# EAGLE design sidInterface (EAGLE 5.11)
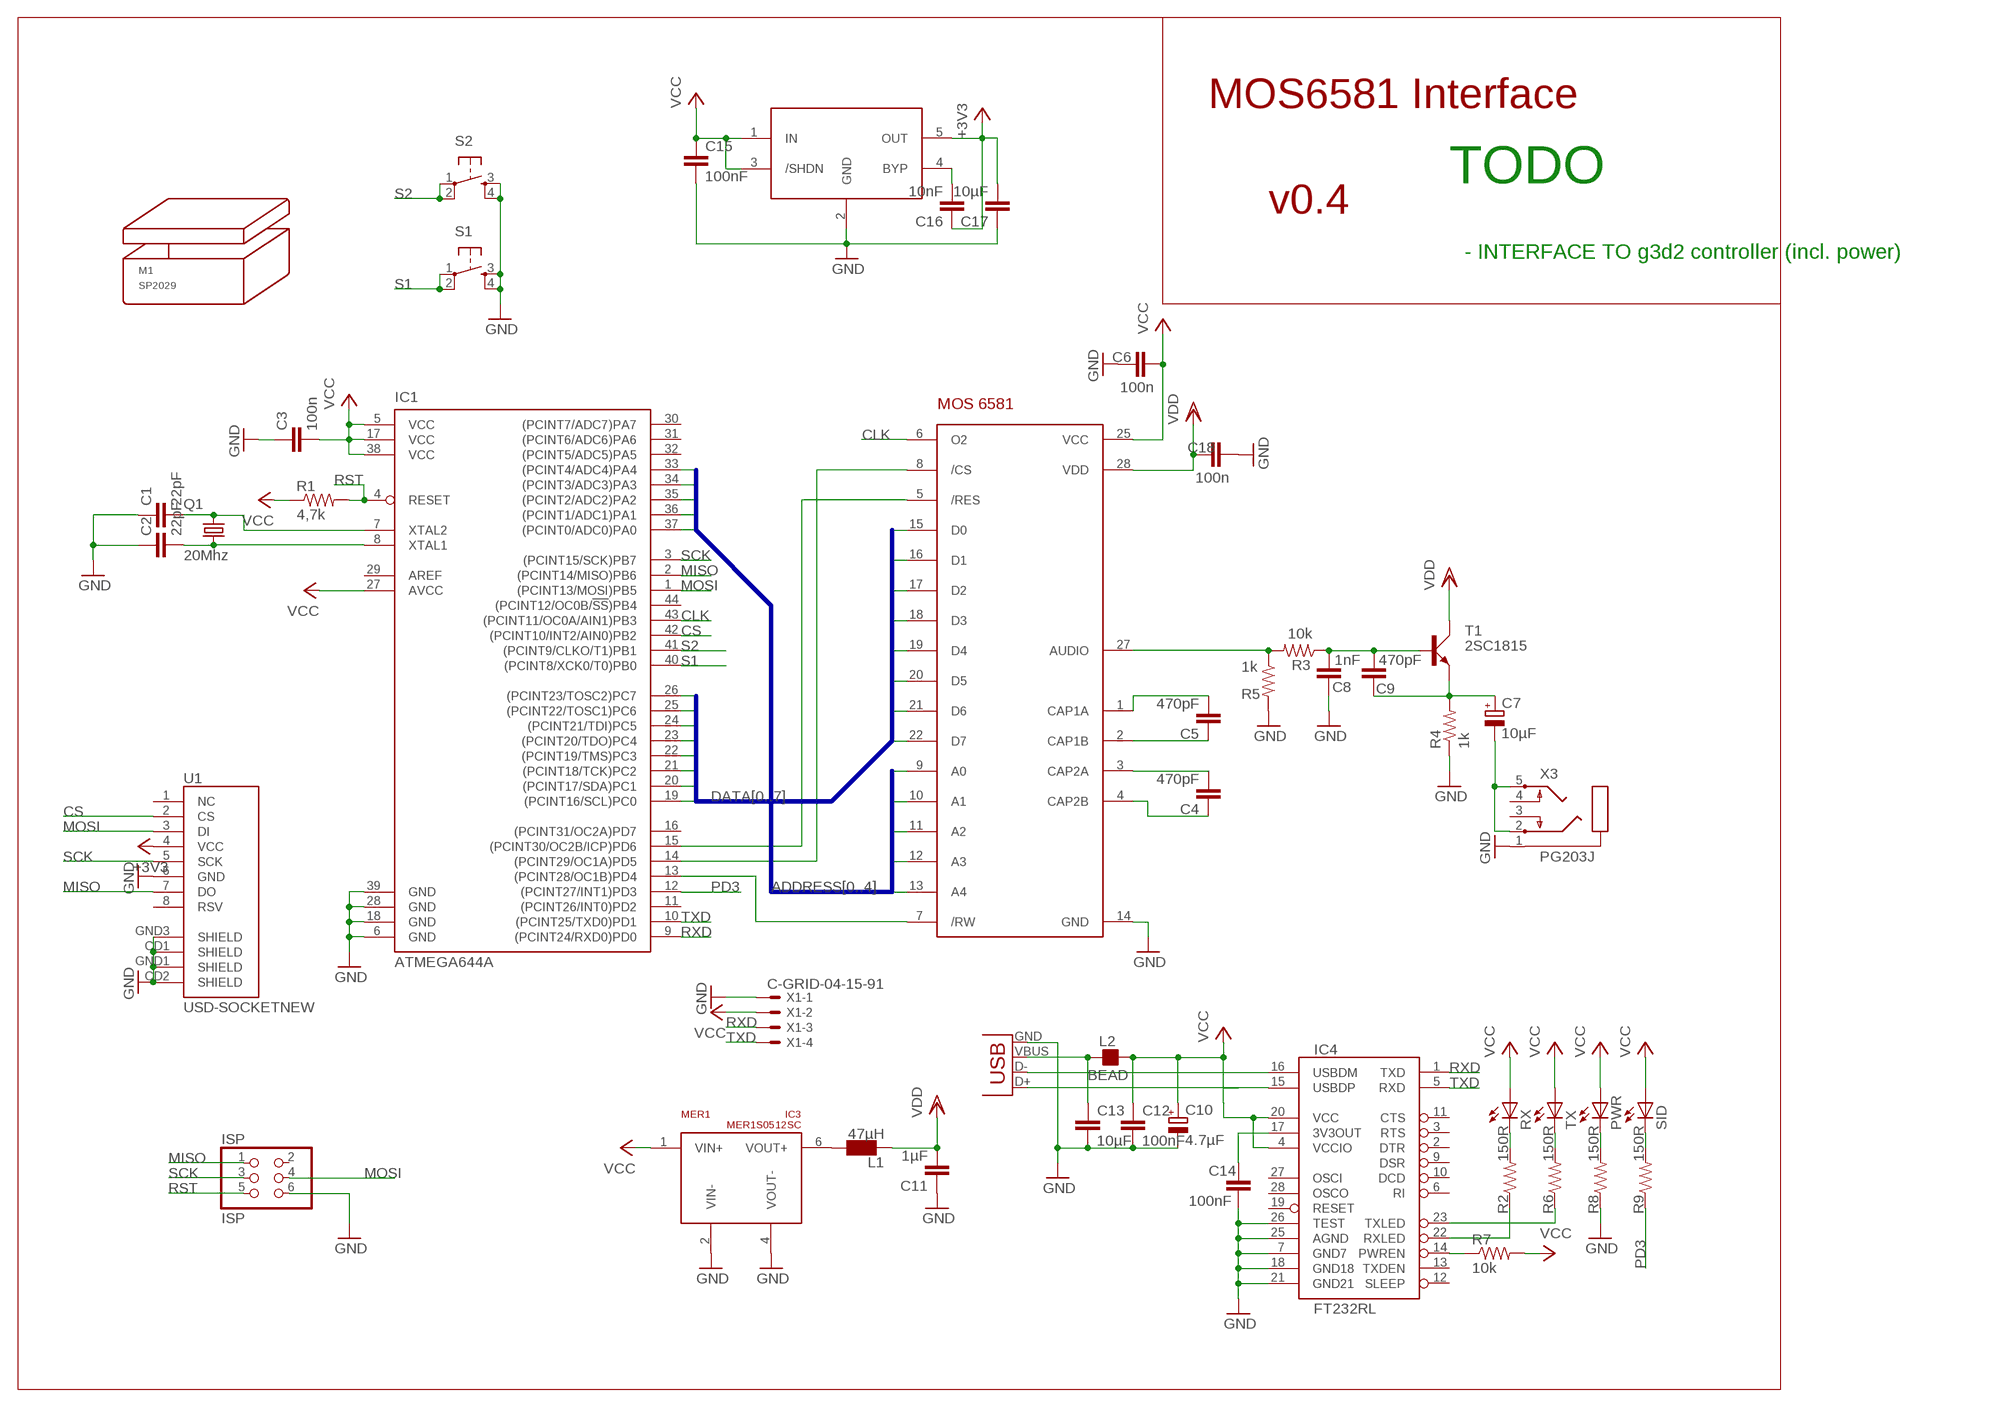
[diagram p0: schematic, sheet 1]

## Parts
C1  22pF  CAP0805  [0805]
C2  22pF  CAP0805  [0805]
C3  100n  CAP0805  [0805]
C4  470pF  CAP0805  [0805]
C5  470pF  CAP0805  [0805]
C6  100n  CAP0805  [0805]
C7  10µF  CPOL-EUSMCC  [SMC_C]
C8  1nF  CAP0805  [0805]
C9  470pF  CAP0805  [0805]
C10  4.7µF  CPOL-EUSMCC  [SMC_C]
C11  1µF  CAP0805  [0805]
C12  100nF  CAP0805  [0805]
C13  10µF  CAP0805  [0805]
C14  100nF  CAP0805  [0805]
C15  100nF  CAP0805  [0805]
C16  10nF  CAP0805  [0805]
C17  10µF  CAP0805  [0805]
C18  100n  CAP0805  [0805]
IC1  ATMEGA644A  [TQFP44]
IC2  MOS6581  [DIL28]
IC3  MER1S0512SC  MURATA_MER1  [MURATA_MER1]
IC4  FT232RL  FT232RLSSOP  [SSOP28DB]
IC5  LT1761  [SOT23-5L]
ISP  ISP  PINHD-2X03_2.54  [2X03]
L1  47µH  PIS2408  [PIS2408]
L2  BEAD  FB_0805  [L0805]
M1  SP2029  [SP2029]
PWR  LED3MM  [LED3MM]
Q1  20Mhz  X22-OSCILLATOR  [X22]
R1  4,7k  RESISTOR  [0805]
R2  150R  RESISTOR  [0805]
R3  10k  RESISTOR  [0805]
R4  1k  RESISTOR  [0805]
R5  1k  RESISTOR  [0805]
R6  150R  RESISTOR  [0805]
R7  10k  RESISTOR  [0805]
R8  150R  RESISTOR  [0805]
R9  150R  RESISTOR  [0805]
RX  LED3MM  [LED3MM]
S1  LSH  [LSH]
S2  LSH  [LSH]
SID  LED3MM  [LED3MM]
T1  2SC1815  BC547  [SOT54A]
TX  LED3MM  [LED3MM]
U1  USD-SOCKETNEW  [MICRO-SD-SOCKET-PP]
X1  C-GRID-04-15-91  [15-91-04]
X2  USB-SMD-NS  [USB-MINIB-NOSTOP]
X3  PG203J  [PG203J]

## Nets
+3V3: C16.1 C17.2 IC5.5(OUT) U1.4(VCC)
ADDRESS0: IC1.37((PCINT0/ADC0)PA0) IC2.9(A0)
ADDRESS1: IC1.36((PCINT1/ADC1)PA1) IC2.10(A1)
ADDRESS2: IC1.35((PCINT2/ADC2)PA2) IC2.11(A2)
ADDRESS3: IC1.34((PCINT3/ADC3)PA3) IC2.12(A3)
ADDRESS4: IC1.33((PCINT4/ADC4)PA4) IC2.13(A4)
CLK: IC1.43((PCINT11/OC0A/AIN1)PB3) IC2.6(O2)
CS: IC1.42((PCINT10/INT2/AIN0)PB2) U1.2(CS)
DATA0: IC1.19((PCINT16/SCL)PC0) IC2.15(D0)
DATA1: IC1.20((PCINT17/SDA)PC1) IC2.16(D1)
DATA2: IC1.21((PCINT18/TCK)PC2) IC2.17(D2)
DATA3: IC1.22((PCINT19/TMS)PC3) IC2.18(D3)
DATA4: IC1.23((PCINT20/TDO)PC4) IC2.19(D4)
DATA5: IC1.24((PCINT21/TDI)PC5) IC2.20(D5)
DATA6: IC1.25((PCINT22/TOSC1)PC6) IC2.21(D6)
DATA7: IC1.26((PCINT23/TOSC2)PC7) IC2.22(D7)
GND: C1.1 C2.1 C3.1 C6.1 C8.1 C10.- C11.1 C12.2 C13.2 C14.2 C15.2 C17.1 C18.2 IC1.6(GND) IC1.18(GND) IC1.28(GND) IC1.39(GND) IC2.14(GND) IC3.2(VIN-) IC3.4(VOUT-) IC4.7(GND7) IC4.18(GND18) IC4.21(GND21) IC4.25(AGND) IC4.26(TEST) IC5.2(GND) ISP.6 R4.1 R5.2 R8.1 S1.3 S1.4 S2.3 S2.4 U1.6(GND) U1.CD1(SHIELD) U1.CD2(SHIELD) U1.GND1(SHIELD) U1.GND3(SHIELD) X1.1 X2.GND X3.1
MISO: IC1.2((PCINT14/MISO)PB6) ISP.1 U1.7(DO)
MOSI: IC1.1((PCINT13/MOSI)PB5) ISP.4 U1.3(DI)
N$1: C2.2 IC1.8(XTAL1) Q1.1
N$2: C1.2 IC1.7(XTAL2) Q1.3
N$4: C4.2 IC2.3(CAP2A)
N$5: C5.1 IC2.2(CAP1B)
N$6: C4.1 IC2.4(CAP2B)
N$7: C5.2 IC2.1(CAP1A)
N$8: IC1.13((PCINT28/OC1B)PD4) IC2.7(/RW)
N$9: IC1.15((PCINT30/OC2B/ICP)PD6) IC2.5(/RES)
N$10: IC1.14((PCINT29/OC1A)PD5) IC2.8(/CS)
N$12: IC3.6(VOUT+) L1.P$1
N$13: R2.2 RX.K(C)
N$14: IC2.27(AUDIO) R3.2 R5.1
N$15: R6.2 TX.K(C)
N$16: C8.2 C9.2 R3.1 T1.B
N$17: C7.+ C9.1 R4.2 T1.E
N$18: IC4.16(USBDM) X2.D-
N$19: C7.- X3.2 X3.5
N$20: IC4.15(USBDP) X2.D+
N$21: PWR.K(C) R8.2
N$22: IC4.23(TXLED) R6.1
N$23: C13.1 L2.1 X2.VBUS
N$24: IC4.14(PWREN) R7.1
N$27: IC4.22(RXLED) R2.1
N$29: C14.1 IC4.17(3V3OUT)
N$43: C16.2 IC5.4(BYP)
PD3: IC1.12((PCINT27/INT1)PD3) R9.1
RST: IC1.4(RESET) ISP.5 R1.2
RXD: IC1.9((PCINT24/RXD0)PD0) IC4.1(TXD) X1.3
S1: IC1.40((PCINT8/XCK0/T0)PB0) S1.1 S1.2
S2: IC1.41((PCINT9/CLKO/T1)PB1) S2.1 S2.2
SCK: IC1.3((PCINT15/SCK)PB7) ISP.3 U1.5(SCK)
SID: R9.2 SID.K(C)
TXD: IC1.10((PCINT25/TXD0)PD1) IC4.5(RXD) X1.4
VCC: C3.2 C6.2 C10.+ C12.1 C15.1 IC1.5(VCC) IC1.17(VCC) IC1.27(AVCC) IC1.38(VCC) IC2.25(VCC) IC3.1(VIN+) IC4.4(VCCIO) IC4.20(VCC) IC5.1(IN) IC5.3(/SHDN) L2.2 PWR.A R1.1 R7.2 RX.A SID.A TX.A X1.2
VDD: C11.2 C18.1 IC2.28(VDD) L1.P$2 T1.C
Unconnected: IC1.11((PCINT26/INT0)PD2) IC1.16((PCINT31/OC2A)PD7) IC1.29(AREF) IC1.30((PCINT7/ADC7)PA7) IC1.31((PCINT6/ADC6)PA6) IC1.32((PCINT5/ADC5)PA5) IC1.44((PCINT12/OC0B/!SS!)PB4) IC4.2(DTR) IC4.3(RTS) IC4.6(RI) IC4.9(DSR) IC4.10(DCD) IC4.11(CTS) IC4.12(SLEEP) IC4.13(TXDEN) IC4.19(RESET) IC4.27(OSCI) IC4.28(OSCO) ISP.2 U1.1(NC) U1.8(RSV) X3.3 X3.4

## Buses
DATA[0..7]
ADDRESS[0..4]

## Notes on the sheet
- MOS6581 Interface
- TODO
- v0.4
- - INTERFACE TO g3d2 controller (incl. power)

## Library data of the parts
C1-C6 C8 C9 C11-C18 = SparkFun:CAP: Capacitor Standard 0603 ceramic capacitor, and 0.1" leaded capacitor.
C7 C10 = resistor:CPOL-EU: POLARIZED CAPACITOR, European symbol
IC1 = atmel:ATMEGA644: 8-bit Microcontroller with 64K Bytes In-System Programmable Flash Source: http://www.atmel.com/dyn/resources/prod_documents/doc2593.pdf; MPN: ATMEGA644PV-10AU; OC_FARNELL: 1455123; OC_NEWARK: 58M3748
IC2 = seb:MOS6581
IC3 = seb:MURATA_MER1
IC4 = SparkFun:FT232RL: USB UART FT232RL 4th Generation USB UART (USB <-> Serial) Controller. Spark Fun Electronics SKU : COM-00650
IC5 = seb:LT1761
ISP = pinhead-2:PINHD-2X03: PIN HEADER
L1 = seb:PIS2408
L2 = rc-master-smd:FB_: FERRITE BEAD
M1 = strapubox:SP2029: Gehäuse Strapubox Typ 2029 max. Bauteilhöhe, top-layer: 11,5 mm max. Bauteilhöhe, bottom-layer: 3,5 mm (Dicke der LP: 1,5 mm) Außenmaße: Länge: 80 mm Breite: 61 mm Höhe: 20,5 mm
PWR RX SID TX = led:LED: LED OSRAM: - CHIPLED LG R971, LG N971, LY N971, LG Q971, LY Q971, LO R971, LY R971 LH N974, LH R974 LS Q976, LO Q976, LY Q976 LO Q996 - Hyper CHIPLED LW Q18S LB Q993, LB Q99A, LB R99A - SideLED LS A670, LO A670, LY A670, LG A670, LP A670 LB A673, LV A673, LT A673, LW A673 LH A674 LY A675 LS A676, LA A676, LO A676, LY A676, LW A676 LS A679, LY A679, LG A679 - Hyper Micro SIDELED® LS Y876, LA Y876, LO Y876, LY Y876 LT Y87S - SmartLED LW L88C, LW L88S LB L89C, LB L89S, LG L890 LS L89K, LO L89K, LY L89K LS L896, LA L896, LO L896, LY L896 - TOPLED LS T670, LO T670, LY T670, LG T670, LP T670 LSG T670, LSP T670, LSY T670, LOP T670, LYG T670 LG T671, LOG T671, LSG T671 LB T673, LV T673, LT T673, LW T673 LH T674 LS T676, LA T676, LO T676, LY T676, LB T676, LH T676, LSB T676, LW T676 LB T67C, LV T67C, LT T67C, LS T67K, LO T67K, LY T67K, LW E67C LS E67B, LA E67B, LO E67B, LY E67B, LB E67C, LV E67C, LT E67C LW T67C LS T679, LY T679, LG T679 LS T770, LO T770, LY T770, LG T770, LP T770 LB T773, LV T773, LT T773, LW T773 LH T774 LS E675, LA E675, LY E675, LS T675 LS T776, LA T776, LO T776, LY T776, LB T776 LHGB T686 LT T68C, LB T68C - Hyper Mini TOPLED® LB M676 - Mini TOPLED Santana® LG M470 LS M47K, LO M47K, LY M47K Source: http://www.osram.convergy.de LUXEON: - LUMILED® LXK2-PW12-R00, LXK2-PW12-S00, LXK2-PW14-U00, LXK2-PW14-V00 LXK2-PM12-R00, LXK2-PM12-S00, LXK2-PM14-U00 LXK2-PE12-Q00, LXK2-PE12-R00, LXK2-PE12-S00, LXK2-PE14-T00, LXK2-PE14-U00 LXK2-PB12-K00, LXK2-PB12-L00, LXK2-PB12-M00, LXK2-PB14-N00, LXK2-PB14-P00, LXK2-PB14-Q00 LXK2-PR12-L00, LXK2-PR12-M00, LXK2-PR14-Q00, LXK2-PR14-R00 LXK2-PD12-Q00, LXK2-PD12-R00, LXK2-PD12-S00 LXK2-PH12-R00, LXK2-PH12-S00 LXK2-PL12-P00, LXK2-PL12-Q00, LXK2-PL12-R00 Source: www.luxeon.com KINGBRIGHT: KA-3528ASYC Source: www.kingbright.com
Q1 = seb:X22-OSCILLATOR
R1-R9 = SparkFun:RESISTOR: Resistor Basic schematic elements and footprints for 0603, 1206, and PTH 1/10th watt (small) resistors.
S1 S2 = switch-tact:LSH
T1 = transistor-small-signal:BC547: NPN TRANSISTOR
U1 = SparkFun:USD-SOCKET: microSD Socket Push-push type uSD socket. Schematic element and footprint production proven. Spark Fun Electronics SKU : PRT-00127. tDoc lines correctly indicate media card edge positions when inserting (unlocked, locked, depressed).
X1 = con-molex:C-GRID-04: CONNECTOR wire to board 2.54 mm (0.100") pitch header; OC_FARNELL: unknown; OC_NEWARK: unknown
X2 = SparkFun:USB: USB Connectors USB-B-PTH is fully proven SKU : PRT-00139 USB-miniB is fully proven SKU : PRT-00587 USB-A-PCB is untested. USB-A-H is throughly reviewed, but untested. Spark Fun Electronics SKU : PRT-00437 USB-B-SMT is throughly reviewed, but untested. Needs silkscreen touching up. USB-A-S has not been used/tested USB-MB-H has not been used/tested
X3 = con-hirschmann:PG203J: MIC/HEADPHONE JACK KS-S stereo microphone/headphone jack PG203JN (Schukat); OC_FARNELL: unknown; OC_NEWARK: unknown

## Board
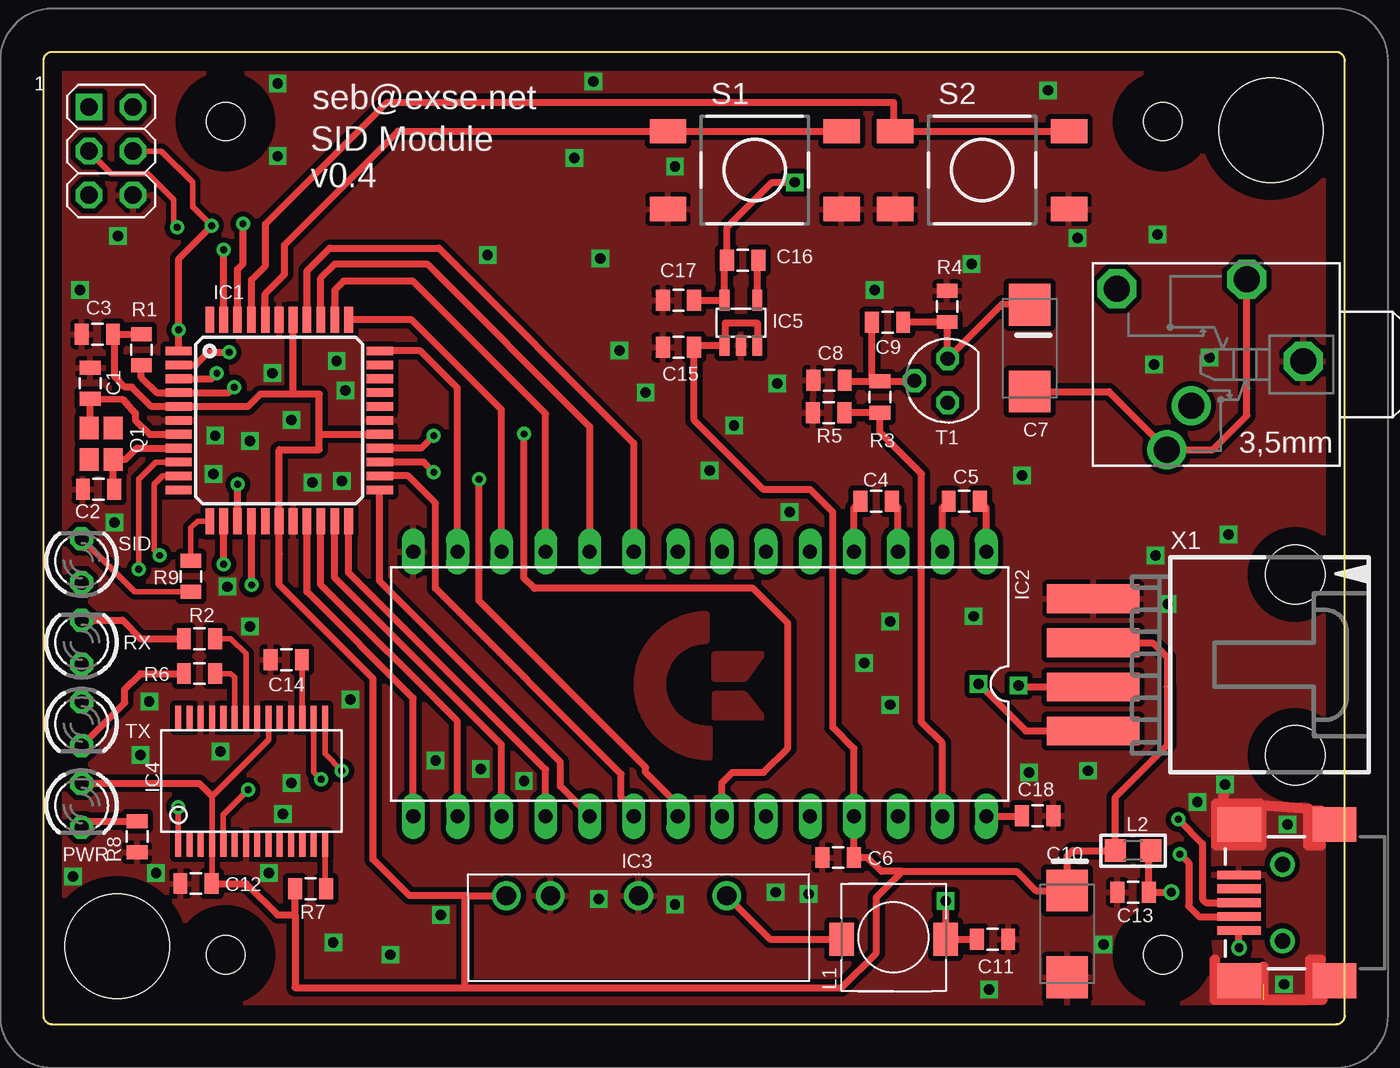
[diagram p1: board, top side]
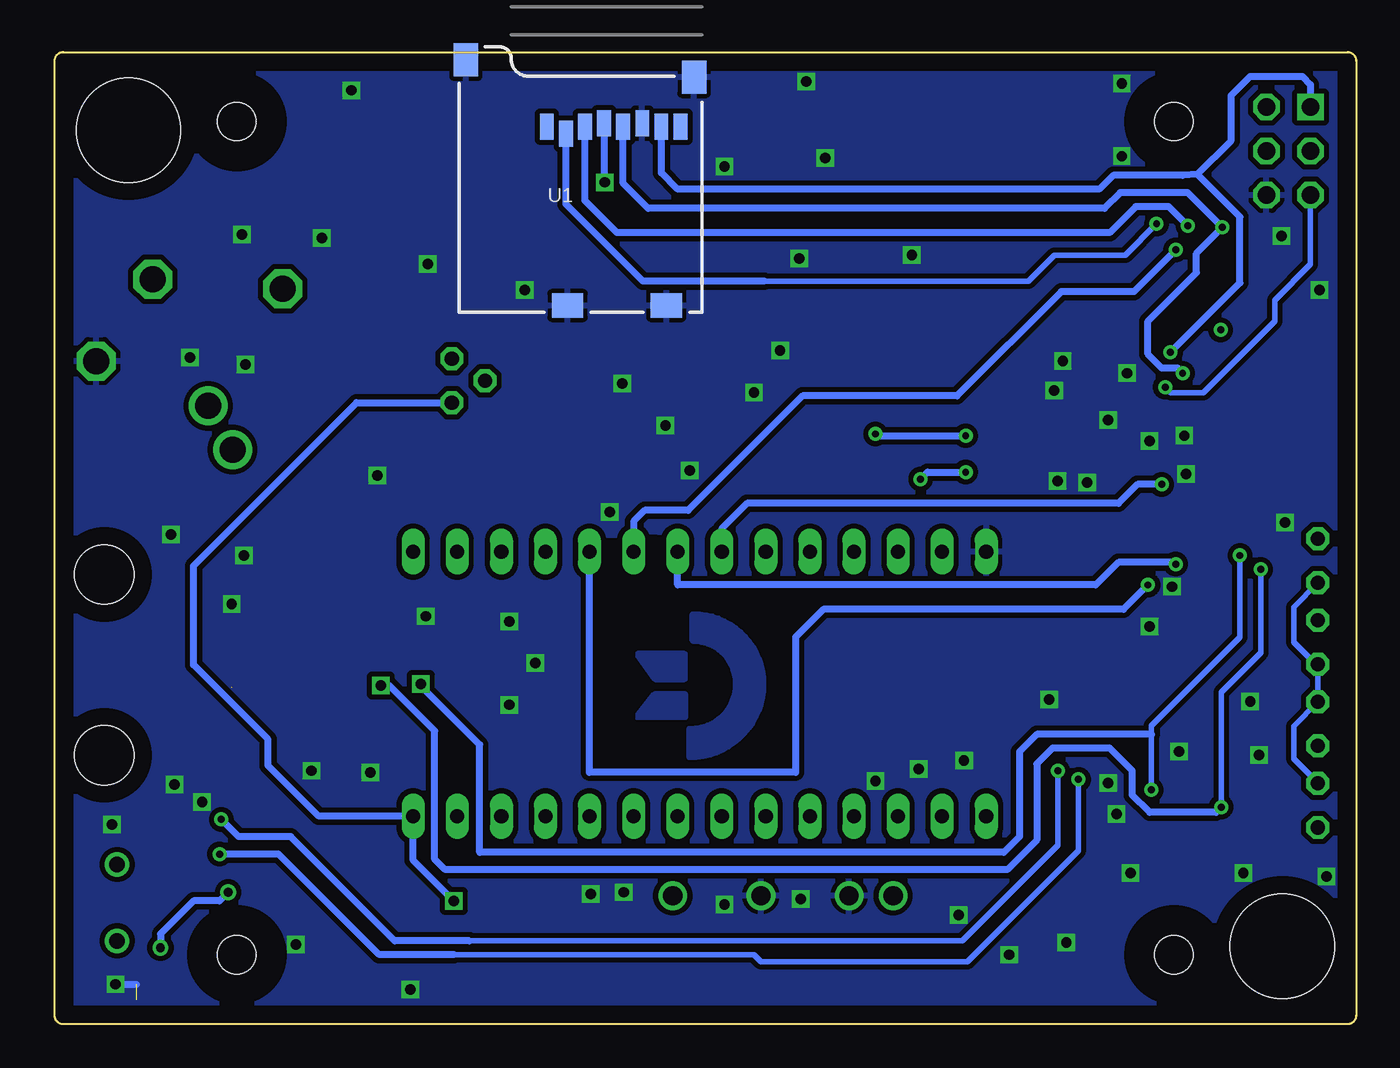
[diagram p2: board, bottom side, seen from below]

Size 75 x 56 mm. Coordinates in mm from the lower left corner, seen from the top.
Copper layers (1*16): Top 0.035mm / dielectric 1.5mm / Bottom 0.035mm
Design rules "default *": minimum track width 10mil, minimum drill 0.4mm, track to track 8mil, track to pad 8mil, pad to pad 8mil, via to via 8mil, smd to smd 8mil, copper to edge 40mil, drill to drill 8mil, minimum pad ring 10mil, minimum via ring 8mil, stop-mask expansion 4mil, vias tented up to drill 24mil, thermal gap 10mil
tRestrict: 2 lines
bRestrict: 2 lines

### Footprints (pad centres in the part's own frame; a part is rotated, then mirrored left to right if it is on the bottom)
0805 = smd 0.8 x 1.2: 1 -0.9,0; 2 0.9,0
SMC_C = smd 2.4 x 2.4: + -2.5,0; - 2.5,0
TQFP44 = smd 1.5 x 0.5: 1 -5.8,4; 2 -5.8,3.2; 3 -5.8,2.4; 4 -5.8,1.6; 5 -5.8,0.8; 6 -5.8,0; 7 -5.8,-0.8; 8 -5.8,-1.6; 9 -5.8,-2.4; 10 -5.8,-3.2; 11 -5.8,-4; 23 5.8,-4; 24 5.8,-3.2; 25 5.8,-2.4; 26 5.8,-1.6; 27 5.8,-0.8; 28 5.8,0; 29 5.8,0.8; 30 5.8,1.6; 31 5.8,2.4; 32 5.8,3.2; 33 5.8,4 | smd 0.5 x 1.5: 12 -4,-5.8; 13 -3.2,-5.8; 14 -2.4,-5.8; 15 -1.6,-5.8; 16 -0.8,-5.8; 17 0,-5.8; 18 0.8,-5.8; 19 1.6,-5.8; 20 2.4,-5.8; 21 3.2,-5.8; 22 4,-5.8; 34 4,5.8; 35 3.2,5.8; 36 2.4,5.8; 37 1.6,5.8; 38 0.8,5.8; 39 0,5.8; 40 -0.8,5.8; 41 -1.6,5.8; 42 -2.4,5.8; 43 -3.2,5.8; 44 -4,5.8
DIL28 = drill 0.813 long: 1 -16.51,-7.62; 2 -13.97,-7.62; 3 -11.43,-7.62; 4 -8.89,-7.62; 5 -6.35,-7.62; 6 -3.81,-7.62; 7 -1.27,-7.62; 8 1.27,-7.62; 9 3.81,-7.62; 10 6.35,-7.62; 11 8.89,-7.62; 12 11.43,-7.62; 13 13.97,-7.62; 14 16.51,-7.62; 15 16.51,7.62; 16 13.97,7.62; 17 11.43,7.62; 18 8.89,7.62; 19 6.35,7.62; 20 3.81,7.62; 21 1.27,7.62; 22 -1.27,7.62; 23 -3.81,7.62; 24 -6.35,7.62; 25 -8.89,7.62; 26 -11.43,7.62; 27 -13.97,7.62; 28 -16.51,7.62
MURATA_MER1 = drill 1.1 round: 1 -7.62,0; 2 -5.08,0; 4 0,0; 6 5.08,0
SSOP28DB = smd 0.348 x 1.397: 1 -4.225,-3.656; 2 -3.575,-3.656; 3 -2.925,-3.656; 4 -2.275,-3.656; 5 -1.625,-3.656; 6 -0.975,-3.656; 7 -0.325,-3.656; 8 0.325,-3.656; 9 0.975,-3.656; 10 1.625,-3.656; 11 2.275,-3.656; 12 2.925,-3.656; 13 3.575,-3.656; 14 4.225,-3.656; 15 4.225,3.656; 16 3.575,3.656; 17 2.925,3.656; 18 2.275,3.656; 19 1.625,3.656; 20 0.975,3.656; 21 0.325,3.656; 22 -0.325,3.656; 23 -0.975,3.656; 24 -1.625,3.656; 25 -2.275,3.656; 26 -2.925,3.656; 27 -3.575,3.656; 28 -4.225,3.656
SOT23-5L = smd 0.55 x 1.2: 1 -0.95,-1.3; 2 0,-1.3; 3 0.95,-1.3; 4 0.95,1.3; 5 -0.95,1.3
2X03 = drill 1.016 square: 1 -2.54,-1.27 | drill 1.016 octagon: 2 -2.54,1.27; 3 0,-1.27; 4 0,1.27; 5 2.54,-1.27; 6 2.54,1.27
PIS2408 = smd 1.4 x 1.9: P$1 -3,-0.1; P$2 3,-0.1
L0805 = smd 1.2 x 1.3: 1 -1.016,0; 2 1.016,0
SP2029 = hole 2.2: -27,-24; -27,24; 27,24; 27,-24 | hole 6: 33.25,23.5; -33.25,-23.5
LED3MM = drill 0.813 octagon: A -1.27,0; K 1.27,0
X22 = smd 1.3 x 1.1: 1 0.9,0.7; 2 -0.9,0.7; 3 -0.9,-0.7; 4 0.9,-0.7
LSH = smd 2.1 x 1.4: 1 -5.005,2.24; 2 5.015,2.24; 3 -5.005,-2.24; 4 5.005,-2.24
SOT54A = drill 0.813 octagon: B 0,1.905; C -1.27,0; E 1.27,0
MICRO-SD-SOCKET-PP = smd 0.8 x 1.5: 1 -8.94,10.7; 2 -7.84,10.3; 3 -6.74,10.7; 4 -5.64,10.9; 5 -4.54,10.7; 6 -3.44,10.9; 7 -2.34,10.7; 8 -1.24,10.7 | smd 1.8 x 1.4: CD1 -2.05,0.4; CD2 -7.75,0.4 | smd 1.4 x 1.9: GND1 -13.6,14.55; GND3 -0.45,13.55
15-91-04 = smd 1.651 x 5.334: 1 -3.81,-10.795; 2 -1.27,-10.795; 3 1.27,-10.795; 4 3.81,-10.795 | hole 3.404: -5.207,0.838; 5.207,0.838
USB-MINIB-NOSTOP = smd 2.5 x 0.5: D+ 2.5,0; D- 2.5,0.8; GND 2.5,-1.6; ID 2.5,-0.8; VBUS 2.5,1.6 | smd 2.5 x 2: G1 -3,-4.5; G2 -3,4.5; G3 2.5,4.5; G4 2.5,-4.5 | drill 0.9 pad 0.8 round: H1 0,2.2 | drill 0.9 pad 0.787 round: H2 0,-2.2
PG203J = drill 1.499 octagon: 1 -5.004,-0.203; 4 5.74,-4.369; 5 -1.753,-4.902 | drill 1.499 round: 2 2.845,4.902; 3 1.448,2.388

### Placement (x,y rotation side)
C1  2.7,36.92 270 top
C2  3.18,30.82 0 top
C3  3.11,39.74 0 top
C4  47.99,30.13 0 top
C5  53.07,30.13 0 top
C6  45.8,9.6 0 top
C7  56.84,38.94 270 top
C8  45.28,37.1 0 top
C9  48.65,40.44 180 top
C10  59,5.2 270 top
C11  54.7,4.9 180 top
C12  8.8,8.1 180 top
C13  62.8,7.6 180 top
C14  14,21 180 top
C15  36.6,39 180 top
C16  40.3,44 0 top
C17  36.6,41.7 0 top
C18  57.3,12 0 top
IC1  13.59,34.78 0 top
IC2  37.83,19.6 180 top
IC3  34.3,7.4 0 top
IC4  12,14 0 top
IC5  40.2,40.4 0 top
ISP  3.9,50.3 270 top
L1  49,5 0 top
L2  62.8,10 180 top
M1  37.5,28 0 top
PWR  2.2,12.6 270 top
Q1  3.33,33.44 270 top
R1  5.65,38.85 270 top
R2  9,22.2 180 top
R3  48.2,36.13 270 top
R4  52.08,41.35 270 top
R5  45.26,35.23 180 top
R6  9,20.2 180 top
R7  15.4,7.8 180 top
R8  5.4,10.8 90 top
R9  8.5,25.8 270 top
RX  2.2,22 90 top
S1  41,49.2 0 top
S2  54.1,49.2 0 top
SID  2.2,26.7 90 top
T1  52.11,37.07 90 top
TX  2.2,17.3 270 top
U1  37.7,41 0 bottom
X1  71.3,20.7 270 top
X2  71.4,7 180 top
X3  67.6,38 180 top

### Tracks (layer width: path | path; a pad name or v marks a point on that pad's centre or on a via)
+3V3  (via drill 0.6)
  Top 0.406: C17.2 IC5.5 39.25,43.85 C16.1 39.4,45.9 42,48.5 v43.3,48.5
  Bottom 0.406: U1.4 43.3,51.9 v43.3,48.5
ADDRESS0
  Top 0.406: IC2.9 34.02,33.48 22.8,44.7 16.5,44.7 15.19,43.39 IC1.37
ADDRESS1
  Top 0.406: IC2.10 31.48,34.42 22.1,43.8 16.8,43.8 15.99,42.99 IC1.36
ADDRESS2
  Top 0.406: IC2.11 28.94,35.16 21.3,42.8 17.3,42.8 16.79,42.29 IC1.35
ADDRESS3
  Top 0.406: IC2.12 26.4,35.4 21.22,40.58 IC1.34
ADDRESS4
  Top 0.406: IC2.13 23.86,36.64 21.72,38.78 IC1.33
C64
  pour Bottom: 38.2,23.6 arc90 34.2,19.6 arc90 38.4,15.4 38.4,17 38.3,17 arc-90 35.7,19.6 arc-90 38.2,22.1 38.2,23.5 arc90
  pour Bottom: 38.7,17.7 41.4,17.7 40.4,19 38.7,19
  pour Bottom: 38.7,21.3 41.4,21.3 40.4,19.9 38.7,19.9
  pour Top: 38.2,23.6 arc90 34.2,19.6 arc90 38.4,15.4 38.4,17 38.3,17 arc-90 35.7,19.6 arc-90 38.2,22.1 38.2,23.5 arc90
  pour Top: 38.7,21.3 41.4,21.3 40.4,19.9 38.7,19.9
  pour Top: 38.7,17.7 41.4,17.7 40.4,19 38.7,19
CLK  (via drill 0.4)
  Top 0.406: v10.4,44.6 IC1.43
  Bottom 0.406: v10.4,44.6 12.8,42.2 17,42.2 23,36.2 31.9,36.2 38.5,29.6 41,29.6 41.64,28.96 IC2.6
CS  (via drill 0.4)
  Top 0.406: v11.5,46.1 11.5,43.8 11.19,43.49 IC1.42
  Bottom 0.305: 34.1,42.8 18.9,42.8 17.4,44.3 13.3,44.3 v11.5,46.1
  Bottom 0.406: U1.2 45.54,47.24 41.1,42.8 34.1,42.8
DATA0
  Top 0.406: IC2.15 21.32,18.78 15.19,24.91 IC1.19
DATA1
  Top 0.406: IC2.16 23.86,17.44 15.99,25.31 IC1.20
DATA2
  Top 0.406: IC2.17 26.4,16.1 16.79,25.71 IC1.21
DATA3
  Top 0.406: IC2.18 28.94,14.66 17.59,26.01 IC1.22
DATA4
  Top 0.406: IC1.23 19.39,25.51 29.8,15.1 29.8,13.7 31.48,12.02 IC2.19
DATA5
  Top 0.406: IC1.24 21.02,31.58 22.6,30 22.6,25.1 33.3,14.4 33.3,13.1 33.92,12.48 33.92,11.98 IC2.20
DATA6  (via drill 0.4)
  Top 0.406: v22.5,31.8 21.92,32.38 IC1.25 | IC2.21 36.56,12.64 34.7,14.5 34.7,14.8 25.1,24.4 v25.1,31.4
  Bottom 0.406: v25.1,31.4 24.7,31.8 v22.5,31.8
DATA7  (via drill 0.4)
  Top 0.406: IC2.22 39.1,13.9 39.7,14.5 41.5,14.5 42.9,15.9 42.9,23.1 40.9,25.1 28.3,25.1 27.7,25.7 v27.7,34 | v22.5,33.9 21.78,33.18 IC1.26
  Bottom 0.406: v27.7,34 27.6,33.9 v22.5,33.9
GND  (via drill 0.6)  (1 unrouted)
  Top 0.305: IC4.7 11.68,10.22 | 9.73,17.32 IC4.25 | IC4.26 9.08,17.52 | IC4.21 12.33,17.82 | IC4.18 14.28,17.74
  Top 0.61: 67.6,10.4 67.6,12.7 70.1,12.7 70.2,12.6 | 70.2,12.6 70.2,10.3 67.6,10.3 67.6,10.4 | 73.6,10.3 72.9,10.3 72.9,12.4 | 73.6,12.3 73,12.3 72.9,12.4 | 73.6,3.7 73,3.7 73,1.4 | 73,1.4 73.7,1.4 | 67.5,3.7 67.5,1.4 70.3,1.4 | 70.3,1.4 70.3,3.3 | 67.6,10.4 v68.1,13.8 | 70.2,12.6 72.9,12.4 | 70.3,1.4 73,1.4
  Bottom 0.406: v71.5,2.3 70.3,2.3
  other vias: 11.9,33.6 32,7.2 14.3,34.8 17.2,31.3 16.9,38.2 13.5,54.2 9.9,33.9 57.9,53.8 64.2,45.5 13.2,37.5 17.4,36.5 15.5,31.2 17.7,18.7 4.1,28.9 10.6,25.2 25.2,14.7 22.6,15.2 5.6,15.5 22.9,6.3 64.8,24.2 53.6,23.5 48.8,23.2 48.8,18.4 1.7,8.5 14.3,13.9 16.7,4.7 13,8.7 13.8,12.1 10.2,15.7 6.1,18.6 11.9,22.9 4.3,45.4 31.7,54.3 36.4,49.4 66.5,12.8 60.2,14.6 71.7,11.5 56.8,14.5 33.2,38.8 36.4,6.9 54.5,2 61.1,4.6 20,4 47.9,42.3 64.1,27 25.6,44.3 13.5,50 27.7,14 42.2,7.6 44.1,7.5 68.3,28.2 53.5,43.8 9.8,31.7 47.3,20.8 34.7,36.4 67.2,38.4 64,38 59.6,45.3 30.6,49.9 42.3,36.9 38.4,31.9 56.4,31.6 43,29.5 39.8,34.5 32.1,44.1 2.1,42.3 6.5,8.7
  pour Top (isolate 0.3): -0.6,56.6 76,56.6 75.3,-0.6 -0.6,-0.5
  pour Bottom (isolate 0.3): -0.5,56.6 75.8,56.5 75.3,-0.6 -0.6,-0.4
MISO  (via drill 0.4)
  Top 0.406: v10.7,38.7 9.5,38.7 8.78,37.98 IC1.2
  Bottom 0.406: 10.7,38.9 v10.7,38.7 6.7,42.7 6.7,46.5 9.15,48.95 | U1.7 40.04,49.04 39.1,48.1 14.8,48.1 14,48.9 10,48.9 9.15,48.95 | ISP.1 2.63,54.13 3.1,54.6 6.1,54.6 7.2,53.5 7.2,50.9 9.15,48.95
MOSI  (via drill 0.4)
  Top 0.305: ISP.4 6.8,50.3 8.6,48.5 8.6,47.1 v9.7,46
  Top 0.406: IC1.1 7.81,38.8 v7.8,40 7.8,44.1 v9.7,46
  Bottom 0.406: U1.3 44.44,47.44 42.6,45.6 14.2,45.6 12.7,47.1 10.8,47.1 v9.7,46
N$1
  Top 0.406: C2.2 4.03,30.67 Q1.1 4.74,32.54 5.38,33.18 IC1.8
N$2
  Top 0.406: 2.83,34.35 Q1.3 2.7,34.41 C1.2 4.6,36 5.3,35.2 5.3,34.8 6.12,33.98 IC1.7
N$4
  Top 0.406: C4.2 49.26,29.76 IC2.3
N$5
  Top 0.406: C5.1 51.8,29.76 IC2.2
N$6
  Top 0.406: C4.1 46.72,29.76 IC2.4
N$7
  Top 0.406: C5.2 54.34,29.76 IC2.1
N$8  (via drill 0.4)
  Top 0.406: v10.4,26.5 IC1.13
  Bottom 0.406: IC2.7 39.1,25.3 15,25.3 13.7,26.6 10.5,26.6 v10.4,26.5
N$9  (via drill 0.4)
  Top 0.406: v12,25.3 IC1.15
  Bottom 0.406: IC2.5 44.18,14.5 32.3,14.5 32.3,20.1 32.3,20.6 32.3,22.3 30.7,23.9 13.4,23.9 v12,25.3
N$10  (via drill 0.4)
  Top 0.406: v11.2,31.1 IC1.14
  Bottom 0.406: v11.2,31.1 12.6,31.1 13.7,30 35.1,30 36.56,28.54 IC2.8
N$12
  Top 0.406: L1.P$1 41.88,4.9 IC3.6
N$13
  Top 0.406: R2.2 5.6,22.2 4.57,23.27 RX.K
N$14
  Top 0.406: R5.1 R3.2 48.2,34.1 50.6,31.7 50.6,17.4 51.8,16.2 IC2.27
N$15
  Top 0.406: TX.K 4.7,18.53 4.7,19.3 5.6,20.2 R6.2
N$16
  Top 0.406: T1.B 50.2,37.03 R3.1 47.75,37.03 | 47.75,37.03 46,37.03 C8.2 | 47.75,37.03 C9.2
N$17
  Top 0.406: C9.1 R4.2 52.11,39.85 T1.E 55.26,41.49 C7.+
N$18  (via drill 0.4)
  Top 0.305: IC4.16 15.58,14.52 v16,14.1
  Top 0.406: X2.D- 66.6,6.2 66,6.8 66,9.3 v65.5,9.8
  Bottom 0.305: 52,4 34.7,4 34.3,3.6 22.4,3.6 16,10 v16,14.1
  Bottom 0.406: 52,4 56.3,4 62.1,9.8 v65.5,9.8
N$19
  Top 0.406: X3.5 69.35,35.05 67.4,33.1 X3.2 61.41,36.44 C7.-
N$20  (via drill 0.4)
  Top 0.305: IC4.15 16.23,15.57 v17.2,14.6
  Top 0.406: X2.D+ 67,7 66.8,7.2 66.8,10.4 v65.4,11.8
  Bottom 0.305: 51.1,4.8 22.7,4.8 17.2,10.3 v17.2,14.6
  Bottom 0.406: 51.1,4.8 55.4,4.8 61.4,10.8 64.4,10.8 v65.4,11.8
N$21
  Top 0.406: PWR.K 2.23,11.33 2.6,11.7 R8.2
N$22
  Top 0.305: IC4.23 11.03,19.98 10.8,20.2 R6.1
N$23  (via drill 0.5)
  Top 0.406: v68.9,4.4 X2.VBUS | v65,7.6 C13.1 63.7,9.88 L2.1
  Bottom 0.406: v68.9,4.4 68.9,5.2 67,7.1 65.5,7.1 v65,7.6
N$24
  Top 0.305: IC4.14 16.23,7.8 R7.1
N$27
  Top 0.305: IC4.22 11.68,21.32 10.8,22.2 R2.1
N$29
  Top 0.305: IC4.17 14.93,19.77 C14.1
N$43
  Top 0.406: C16.2 41.15,43.95 IC5.4
PD3
  Top 0.305: IC1.12 8.88,28.98 8.5,28.6 R9.1
RST  (via drill 0.4)
  Top 0.406: R1.2 5.65,37.25 6.52,36.38 IC1.4 10.68,36.38 v11,36.7
  Bottom 0.305: ISP.5 2.63,43.77 4.7,41.7 4.7,40.48 8.8,36.38 10.68,36.38 v11,36.7
RXD  (via drill 0.4, 0.6)
  Top 0.305: IC1.9 6.48,32.38 5.5,31.4 v5.5,26.2 | IC4.1 v7.78,12.5
  Top 0.406: v56.2,19.5 56.27,19.43 X1.3
  Bottom 0.305: v7.78,12.5 7.78,19.12 5.5,21.4 v5.5,26.2
  Bottom 0.406: v7.78,12.5 8.08,12.2 11.9,12.2 12.9,13.2 12.9,14.6 14.2,15.9 17.5,15.9 18.4,15 18.4,10.6 20.1,8.9 52.5,8.9 53.1,9.5 53.1,16.9 55.7,19.5 v56.2,19.5
S1
  Top 0.406: S1.2 S1.1 20.44,51.44 13.9,44.9 13.9,43.2 12.79,42.09 IC1.40
S2
  Top 0.406: S2.2 S2.1 49,51.53 49,53.1 19.8,53.1 12.8,46.1 12.8,43.7 11.99,42.89 IC1.41
SCK  (via drill 0.4)
  Top 0.305: ISP.3 2.63,50.27 3.9,49 6,49 7.5,47.5 7.5,46.1 v7.7,45.9
  Top 0.406: v10,37.5 9.68,37.18 IC1.3
  Bottom 0.406: U1.5 42.24,48.44 40.8,47 14.5,47 13.6,47.9 9.7,47.9 v7.7,45.9 9.2,44.4 9.2,43.3 12,40.5 12,38.6 11.2,37.8 10.3,37.8 v10,37.5
SID
  Top 0.305: R9.2 5.27,24.9 SID.K
TXD  (via drill 0.4, 0.6)
  Top 0.305: IC4.5 10.38,12.07 v11.8,13.5 | IC1.10 6.88,31.58 6.4,31.1 6.4,27.3 v6.7,27
  Top 0.406: v53.9,19.6 56.61,16.89 X1.4
  Bottom 0.305: v11.8,13.5 11.8,16.7 11.8,17.2 6.7,22.3 v6.7,27
  Bottom 0.406: 11.8,16.7 18.4,16.7 19.4,15.7 19.4,10.8 20.3,9.9 50.5,9.9 50.5,16.1 53.9,19.5 v53.9,19.6
VCC  (1 unrouted)
  Top 0.305: IC4.20 12.98,16.38 9.73,13.12 IC4.4 9.73,8.32 C12.1
  Top 0.406: 15.9,33.98 IC1.27 | 15.9,33.98 15.9,33.1 13.59,33.1 IC1.17 13.59,27.1 13.6,27.1 13.6,25.3 19,19.9 19,9.5 21.1,7.4 24.3,7.4 | 14.39,36.3 15.9,36.3 15.9,33.98 | 14.39,36.3 IC1.38 | 14.39,36.3 12.5,36.3 11.78,35.58 IC1.5 6.22,35.58 5.1,36.7 4.7,36.7 4.1,37.3 4.1,39.65 C3.2 R1.1 | 24.3,2.1 14.5,2.1 14.5,6.3 | 24.3,2.1 24.3,7.4 | 24.3,7.4 IC3.1 | 24.3,2.1 46,2.1 48,4.1 48,7.3 49.5,8.8 | IC5.3 41.15,40.4 39.3,40.4 39.3,39.15 IC5.1 37.6,39.1 C15.1 37.5,34.8 41.5,30.8 44.2,30.8 45.5,29.5 45.5,17.1 46.72,15.88 IC2.25 46.7,11.98 C6.2 47.5,9.6 48.3,8.8 49.5,8.8 | 64.8,19.4 64.8,16.1 61.78,13.08 L2.2 59.3,10 59,9.7 C10.+ 57.2,7.7 56.1,8.8 49.5,8.8 | 9.73,13.12 8.98,13.87 PWR.A | 64.77,19.43 64.77,21.13 63.93,21.97 X1.2 | 14.5,6.3 R7.2 | C12.1 11.7,8.1 13.5,6.3 14.5,6.3
  Bottom 0.305: SID.A 3.6,24.03 3.6,22 2.33,20.73 RX.A TX.A 3.6,17.17 3.6,15.3 2.2,13.9 PWR.A
VDD  (via drill 0.6)
  Top 0.406: IC2.28 56.38,11.98 C18.1 | C11.2 L1.P$2 v52,7.1
  Bottom 0.406: T1.C 57.6,35.8 67,26.4 67,20.7 62.7,16.4 62.7,14.9 59.78,11.98 IC2.28 54.34,9.44 v52,7.1

### Text on the board
tPlace: 1
tNames: seb@exse.net | SID Module | v0.4 | Q1 | IC3 | L1